# Altium schematic sheet ANT-SMD.schdoc
size 124 x 101 mm
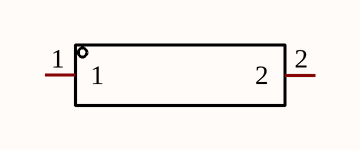
[diagram p0: ANT-SMD.schdoc]

## Parts
U?  ANT3216LL00R2400A  [ANT-SMD_L3.2-W1.6]  (value not drawn)

## Nets

Not connected (* = marked no-connect by the designer): U? 1 2

## Library data of the parts
U? = ANT3216LL00R2400A: Manufacturer: YAGEO(国巨); Add into BOM: yes; Antenna Type: 芯片天线; Central Frequency: 2.45GHz; Bandwidth: 160MHz; Peak Gain: 5.05dBi; Polarization Type: 线性; Impedance: 50Ω; Power capacity: 1W; Symbol: ANT3216LL00R2400A; Device: ANT3216LL00R2400A; Supplier: LCSC; Supplier Part: C293767; Manufacturer Part: ANT3216LL00R2400A; JLCPCB Part Class: Extended Part; LCSC Part Name: 无线组件陶瓷芯片天线; Supplier Footprint: 1206; Datasheet: https://atta.szlcsc.com/upload/public/pdf/source/20181012/C293767_CDE82A2F74DC82A94DB708CB53B68F23.pdf; Convert to PCB: yes; VSWR: -; Operating Temperature: -40℃~+105℃